# Altium schematic sheet LightStickController.SchDoc
size A4
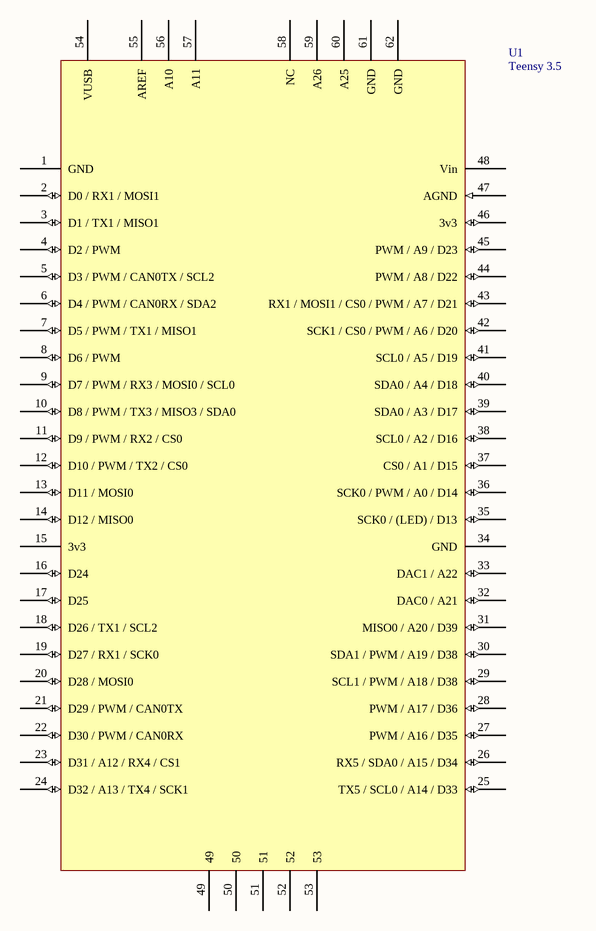
[diagram p0: LightStickController.SchDoc]

## Parts
U1  Teensy 3.5  [TEENSY3.5]

## Nets

Not connected (* = marked no-connect by the designer): U1 1(GND) 2(D0_/_RX1_/_MOSI1) 3(D1_/_TX1_/_MISO1) 4(D2_/_PWM) 5(D3_/_PWM_/_CAN0TX_/_SCL2) 6(D4_/_PWM_/_CAN0RX_/_SDA2) 7(D5_/_PWM_/_TX1_/_MISO1) 8(D6_/_PWM) 9(D7_/_PWM_/_RX3_/_MOSI0_/_SCL0) 10(D8_/_PWM_/_TX3_/_MISO3_/_SDA0) 11(D9_/_PWM_/_RX2_/_CS0) 12(D10_/_PWM_/_TX2_/_CS0) 13(D11_/_MOSI0) 14(D12_/_MISO0) 15(3v3) 16(D24) 17(D25) 18(D26_/_TX1_/_SCL2) 19(D27_/_RX1_/_SCK0) 20(D28_/_MOSI0) 21(D29_/_PWM_/_CAN0TX) 22(D30_/_PWM_/_CAN0RX) 23(D31_/_A12_/_RX4_/_CS1) 24(D32_/_A13_/_TX4_/_SCK1) 25(TX5_/_SCL0_/_A14_/_D33) 26(RX5_/_SDA0_/_A15_/_D34) 27(PWM_/_A16_/_D35) 28(PWM_/_A17_/_D36) 29(SCL1_/_PWM_/_A18_/_D38) 30(SDA1_/_PWM_/_A19_/_D38) 31(MISO0_/_A20_/_D39) 32(DAC0_/_A21) 33(DAC1_/_A22) 34(GND) 35(SCK0_/_(LED)_/_D13) 36(SCK0_/_PWM_/_A0_/_D14) 37(CS0_/_A1_/_D15) 38(SCL0_/_A2_/_D16) 39(SDA0_/_A3_/_D17) 40(SDA0_/_A4_/_D18) 41(SCL0_/_A5_/_D19) 42(SCK1_/_CS0_/_PWM_/_A6_/_D20) 43(RX1_/_MOSI1_/_CS0_/_PWM_/_A7_/_D21) 44(PWM_/_A8_/_D22) 45(PWM_/_A9_/_D23) 46(3v3) 47(AGND) 48(Vin) 49 50 51 52 53 54(VUSB) 55(AREF) 56(A10) 57(A11) 58(NC) 59(A26) 60(A25) 61(GND) 62(GND)